# EAGLE schematic MOL-v1.0 (EAGLE 8.2.2)
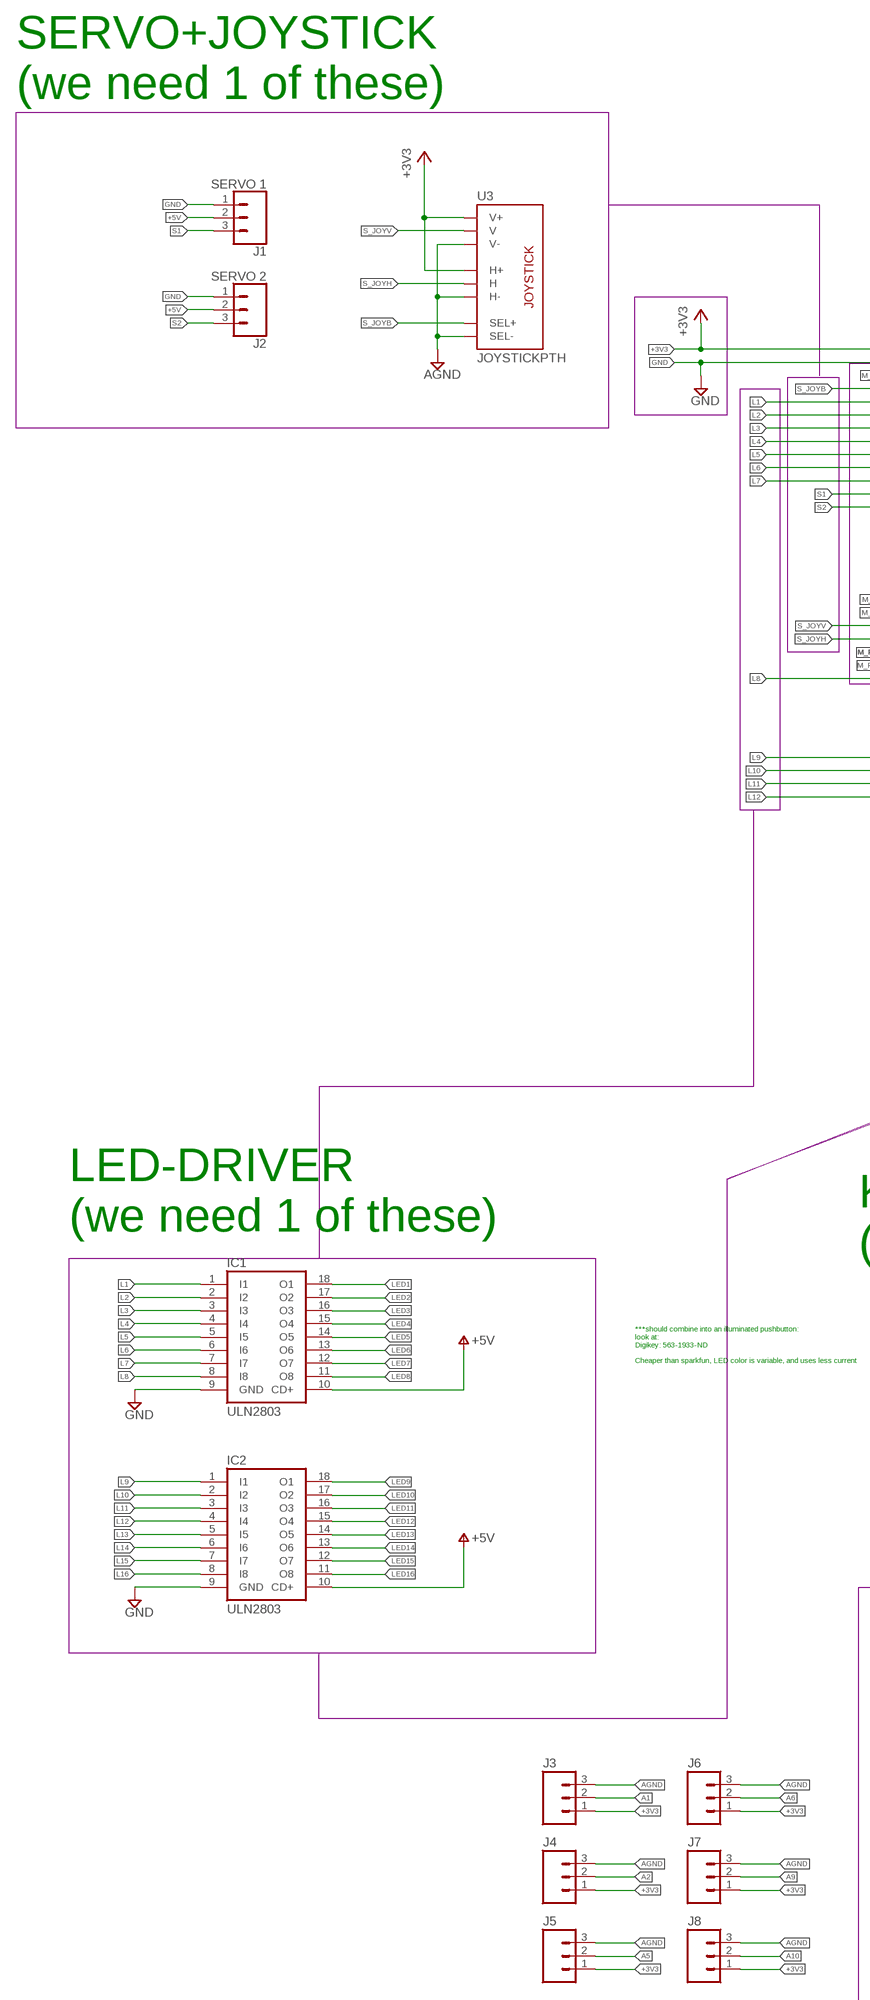
[diagram p0: schematic, sheet 1, part 1 of 2]
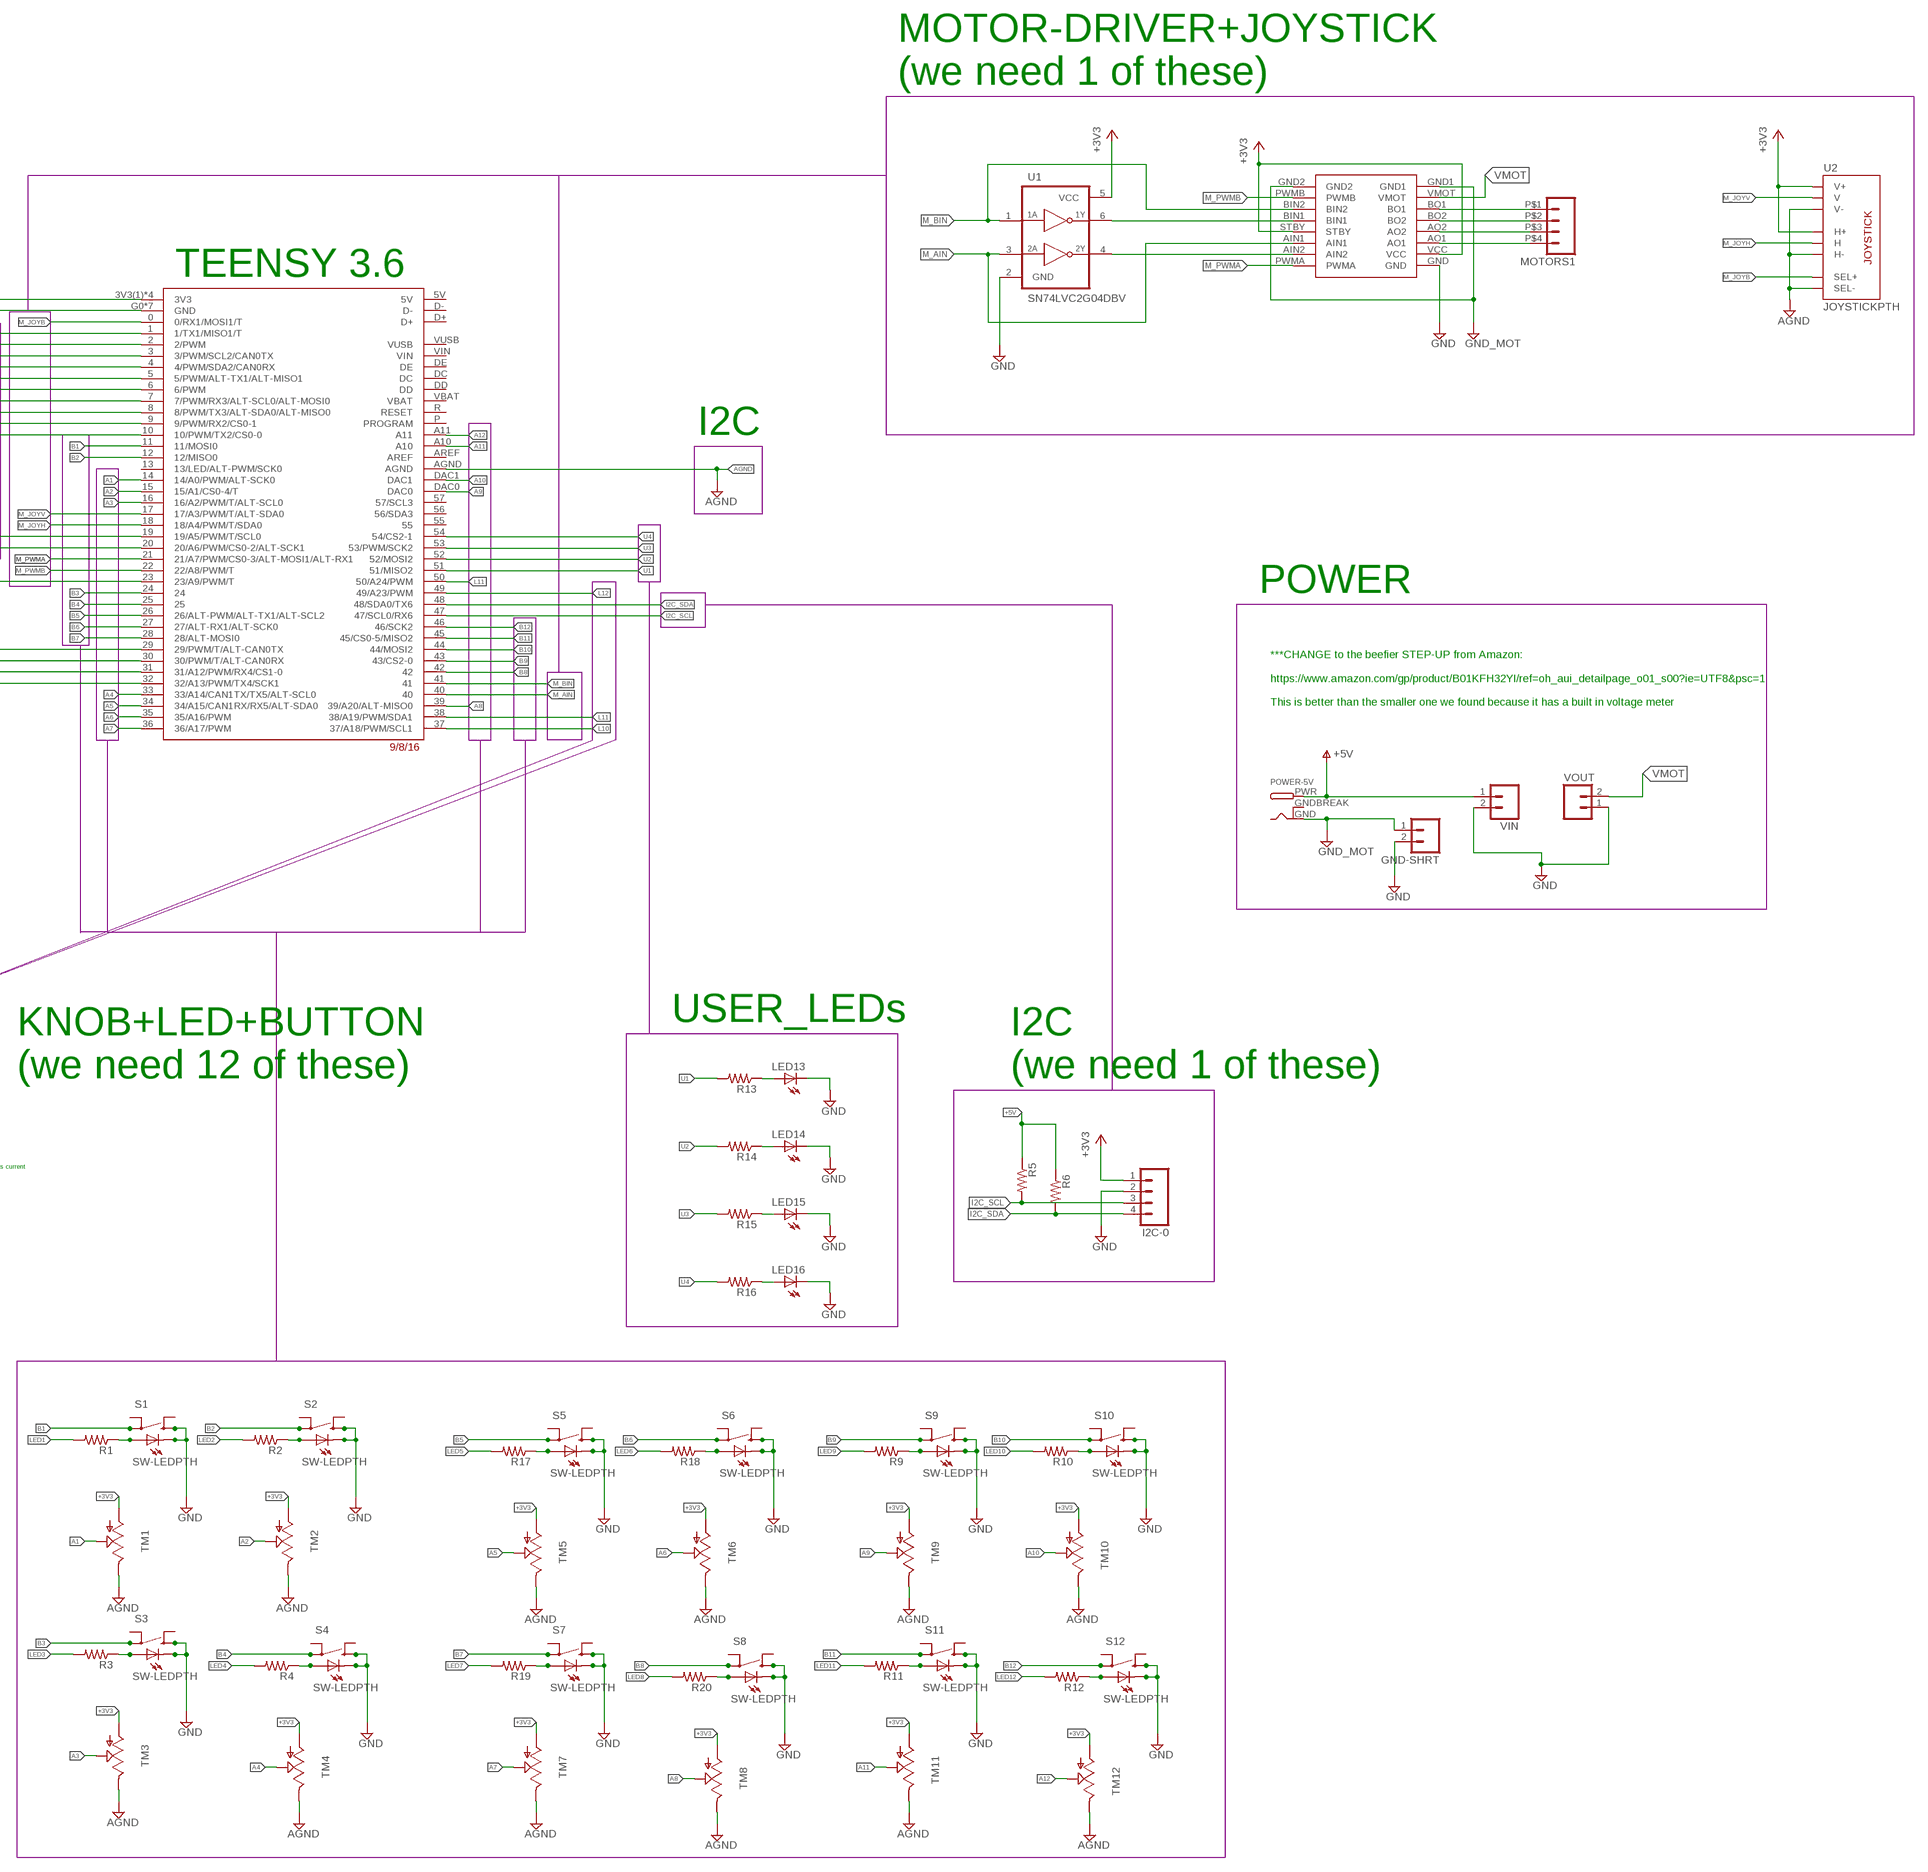
[diagram p1: schematic, sheet 1, part 2 of 2]

## Parts
GND-SHRT  M02LOCK  [1X02_LOCK]
I2C-0  M04LOCK  [1X04_LOCK]
IC1  ULN2803  ULN2803A  [DIL18]
IC2  ULN2803  ULN2803A  [DIL18]
J1  SERVO 1  CONN_03LOCK  [1X03_LOCK@1]
J2  SERVO 2  CONN_03LOCK  [1X03_LOCK@1]
J3  M031X03_NO_SILK  [1X03_NO_SILK]
J4  M031X03_NO_SILK  [1X03_NO_SILK]
J5  M031X03_NO_SILK  [1X03_NO_SILK]
J6  M031X03_NO_SILK  [1X03_NO_SILK]
J7  M031X03_NO_SILK  [1X03_NO_SILK]
J8  M031X03_NO_SILK  [1X03_NO_SILK]
LED13  LED3MM  [LED3MM]
LED14  LED3MM  [LED3MM]
LED15  LED3MM  [LED3MM]
LED16  LED3MM  [LED3MM]
MOTORS1  M04  [SPRINGTERMINAL-2.54MM-4]
POWER-5V  DCBARRELPTH  [DCJACK_2MM_PTH]
R1  RESISTOREZ  [AXIAL-0.3EZ]
R2  RESISTOREZ  [AXIAL-0.3EZ]
R3  RESISTOREZ  [AXIAL-0.3EZ]
R4  RESISTOREZ  [AXIAL-0.3EZ]
R5  RESISTOREZ  [AXIAL-0.3EZ]
R6  RESISTOREZ  [AXIAL-0.3EZ]
R9  RESISTOREZ  [AXIAL-0.3EZ]
R10  RESISTOREZ  [AXIAL-0.3EZ]
R11  RESISTOREZ  [AXIAL-0.3EZ]
R12  RESISTOREZ  [AXIAL-0.3EZ]
R13  RESISTOREZ  [AXIAL-0.3EZ]
R14  RESISTOREZ  [AXIAL-0.3EZ]
R15  RESISTOREZ  [AXIAL-0.3EZ]
R16  RESISTOREZ  [AXIAL-0.3EZ]
R17  RESISTOREZ  [AXIAL-0.3EZ]
R18  RESISTOREZ  [AXIAL-0.3EZ]
R19  RESISTOREZ  [AXIAL-0.3EZ]
R20  RESISTOREZ  [AXIAL-0.3EZ]
S1  SW-LEDPTH  [TR2-SWITCH-MOMENTARY-LED]
S2  SW-LEDPTH  [TR2-SWITCH-MOMENTARY-LED]
S3  SW-LEDPTH  [TR2-SWITCH-MOMENTARY-LED]
S4  SW-LEDPTH  [TR2-SWITCH-MOMENTARY-LED]
S5  SW-LEDPTH  [TR2-SWITCH-MOMENTARY-LED]
S6  SW-LEDPTH  [TR2-SWITCH-MOMENTARY-LED]
S7  SW-LEDPTH  [TR2-SWITCH-MOMENTARY-LED]
S8  SW-LEDPTH  [TR2-SWITCH-MOMENTARY-LED]
S9  SW-LEDPTH  [TR2-SWITCH-MOMENTARY-LED]
S10  SW-LEDPTH  [TR2-SWITCH-MOMENTARY-LED]
S11  SW-LEDPTH  [TR2-SWITCH-MOMENTARY-LED]
S12  SW-LEDPTH  [TR2-SWITCH-MOMENTARY-LED]
TM1  TRIM  [TRIM-PCB-9MM]
TM2  TRIM  [TRIM-PCB-9MM]
TM3  TRIM  [TRIM-PCB-9MM]
TM4  TRIM  [TRIM-PCB-9MM]
TM5  TRIM  [TRIM-PCB-9MM]
TM6  TRIM  [TRIM-PCB-9MM]
TM7  TRIM  [TRIM-PCB-9MM]
TM8  TRIM  [TRIM-PCB-9MM]
TM9  TRIM  [TRIM-PCB-9MM]
TM10  TRIM  [TRIM-PCB-9MM]
TM11  TRIM  [TRIM-PCB-9MM]
TM12  TRIM  [TRIM-PCB-9MM]
U1  SN74LVC2G04DBV  [SOT23-6]
U2  JOYSTICKPTH  [JOYSTICK]
U3  JOYSTICKPTH  [JOYSTICK]
U$1  TEENSY3_6--ALLPINS  [T36]
U$7  POLOLU_TB6612FNG  [POLOLU_TB6612FNG]
VIN  M02LOCK  [1X02_LOCK]
VOUT  M02LOCK  [1X02_LOCK]

## Nets
+3V3: I2C-0.1 J3.1 J4.1 J5.1 J6.1 J7.1 J8.1 TM1.1(A) TM2.1(A) TM3.1(A) TM4.1(A) TM5.1(A) TM6.1(A) TM7.1(A) TM8.1(A) TM9.1(A) TM10.1(A) TM11.1(A) TM12.1(A) U1.5(VCC) U2.H1(H+) U2.V1(V+) U3.H1(H+) U3.V1(V+) U$1.3V3(1)(3V3) U$1.3V3(2)(3V3) U$1.3V3(3)(3V3) U$1.3V3(4)(3V3) U$7.STBY U$7.VCC
+5V [Power]: IC1.10(CD+) IC2.10(CD+) J1.2 J2.2 POWER-5V.PWR R5.P$1 R6.P$1 VIN.1 ; supply symbol labelled V+
A1 [Analog Sig]: J3.2 TM1.2(S) U$1.14(14/A0/PWM/ALT-SCK0)
A2 [Analog Sig]: J4.2 TM2.2(S) U$1.15(15/A1/CS0-4/T)
A3 [Analog Sig]: TM3.2(S) U$1.16(16/A2/PWM/T/ALT-SCL0)
A4 [Analog Sig]: TM4.2(S) U$1.33(33/A14/CAN1TX/TX5/ALT-SCL0)
A5 [Analog Sig]: J5.2 TM5.2(S) U$1.34(34/A15/CAN1RX/RX5/ALT-SDA0)
A6 [Analog Sig]: J6.2 TM6.2(S) U$1.35(35/A16/PWM)
A7 [Analog Sig]: TM7.2(S) U$1.36(36/A17/PWM)
A8 [Analog Sig]: TM8.2(S) U$1.39(39/A20/ALT-MISO0)
A9 [Analog Sig]: J7.2 TM9.2(S) U$1.DAC0
A10 [Analog Sig]: J8.2 TM10.2(S) U$1.DAC1
A11 [Analog Sig]: TM11.2(S) U$1.A10
A12 [Analog Sig]: TM12.2(S) U$1.A11
AGND [Analog Sig]: J3.3 J4.3 J5.3 J6.3 J7.3 J8.3 TM1.3(E) TM2.3(E) TM3.3(E) TM4.3(E) TM5.3(E) TM6.3(E) TM7.3(E) TM8.3(E) TM9.3(E) TM10.3(E) TM11.3(E) TM12.3(E) U2.B2A(SEL-) U2.H3(H-) U2.V3(V-) U3.B2A(SEL-) U3.H3(H-) U3.V3(V-) U$1.AGND
B1: S1.3 U$1.11(11/MOSI0)
B2: S2.3 U$1.12(12/MISO0)
B3: S3.3 U$1.24
B4: S4.3 U$1.25
B5: S5.3 U$1.26(26/ALT-PWM/ALT-TX1/ALT-SCL2)
B6: S6.3 U$1.27(27/ALT-RX1/ALT-SCK0)
B7: S7.3 U$1.28(28/ALT-MOSI0)
B8: S8.3 U$1.42
B9: S9.3 U$1.43(43/CS2-0)
B10: S10.3 U$1.44(44/MOSI2)
B11: S11.3 U$1.45(45/CS0-5/MISO2)
B12: S12.3 U$1.46(46/SCK2)
GND: GND-SHRT.2 I2C-0.2 IC1.9(GND) IC2.9(GND) J1.1 J2.1 LED13.K(C) LED14.K(C) LED15.K(C) LED16.K(C) S1.1 S1.C S2.1 S2.C S3.1 S3.C S4.1 S4.C S5.1 S5.C S6.1 S6.C S7.1 S7.C S8.1 S8.C S9.1 S9.C S10.1 S10.C S11.1 S11.C S12.1 S12.C U1.2(GND) U$1.G0(GND) U$1.G1(GND) U$1.G2(GND) U$1.G3(GND) U$1.G4(GND) U$1.G5(GND) U$1.G6(GND) U$7.GND VIN.2 VOUT.1
GND_MOT [Power]: GND-SHRT.1 POWER-5V.GND U$7.GND1 U$7.GND2
I2C_SCL: I2C-0.3 R5.P$2 U$1.47(47/SCL0/RX6)
I2C_SDA: I2C-0.4 R6.P$2 U$1.48(48/SDA0/TX6)
L1: IC1.1(I1) U$1.2(2/PWM)
L2: IC1.2(I2) U$1.3(3/PWM/SCL2/CAN0TX)
L3: IC1.3(I3) U$1.4(4/PWM/SDA2/CAN0RX)
L4: IC1.4(I4) U$1.5(5/PWM/ALT-TX1/ALT-MISO1)
L5: IC1.5(I5) U$1.6(6/PWM)
L6: IC1.6(I6) U$1.7(7/PWM/RX3/ALT-SCL0/ALT-MOSI0)
L7: IC1.7(I7) U$1.8(8/PWM/TX3/ALT-SDA0/ALT-MISO0)
L8: IC1.8(I8) U$1.23(23/A9/PWM/T)
L9: IC2.1(I1) U$1.29(29/PWM/T/ALT-CAN0TX)
L10: IC2.2(I2) U$1.30(30/PWM/T/ALT-CAN0RX) U$1.37(37/A18/PWM/SCL1)
L11: IC2.3(I3) U$1.31(31/A12/PWM/RX4/CS1-0) U$1.38(38/A19/PWM/SDA1) U$1.50(50/A24/PWM)
L12: IC2.4(I4) U$1.32(32/A13/PWM/TX4/SCK1) U$1.49(49/A23/PWM)
L13: IC2.5(I5)
L14: IC2.6(I6)
L15: IC2.7(I7)
L16: IC2.8(I8)
LED1: IC1.18(O1) R1.P$2
LED2: IC1.17(O2) R2.P$2
LED3: IC1.16(O3) R3.P$2
LED4: IC1.15(O4) R4.P$2
LED5: IC1.14(O5) R17.P$2
LED6: IC1.13(O6) R18.P$2
LED7: IC1.12(O7) R19.P$2
LED8: IC1.11(O8) R20.P$2
LED9: IC2.18(O1) R9.P$2
LED10: IC2.17(O2) R10.P$2
LED11: IC2.16(O3) R11.P$2
LED12: IC2.15(O4) R12.P$2
LED13: IC2.14(O5)
LED14: IC2.13(O6)
LED15: IC2.12(O7)
LED16: IC2.11(O8)
M_AIN: U1.3(2A) U$1.40 U$7.AIN1
M_BIN: U1.1(1A) U$1.41 U$7.BIN2
M_JOYB: U2.B1A(SEL+) U$1.0(0/RX1/MOSI1/T)
M_JOYH [Analog Sig]: U2.H2(H) U$1.18(18/A4/PWM/T/SDA0)
M_JOYV [Analog Sig]: U2.V2(V) U$1.17(17/A3/PWM/T/ALT-SDA0)
M_PWMA: U$1.21(21/A7/PWM/CS0-3/ALT-MOSI1/ALT-RX1) U$7.PWMA
M_PWMB: U$1.22(22/A8/PWM/T) U$7.PWMB
N$1: R1.P$1 S1.A
N$2: LED13.A R13.P$1
N$3: LED14.A R14.P$1
N$4: LED15.A R15.P$1
N$5: U1.6(1Y) U$7.BIN1
N$6: U1.4(2Y) U$7.AIN2
N$7: LED16.A R16.P$1
N$8: R2.P$1 S2.A
N$9: R3.P$1 S3.A
N$10: R4.P$1 S4.A
N$15: R9.P$1 S9.A
N$16: R10.P$1 S10.A
N$17: R11.P$1 S11.A
N$18: R12.P$1 S12.A
N$19: R17.P$1 S5.A
N$20: R18.P$1 S6.A
N$21: R19.P$1 S7.A
N$22: R20.P$1 S8.A
N$45 [Power]: MOTORS1.P$1 U$7.BO1
N$46 [Power]: MOTORS1.P$2 U$7.BO2
N$52 [Power]: MOTORS1.P$3 U$7.AO2
N$54 [Power]: MOTORS1.P$4 U$7.AO1
S1: J1.3 U$1.9(9/PWM/RX2/CS0-1)
S2: J2.3 U$1.10(10/PWM/TX2/CS0-0)
S_JOYB: U3.B1A(SEL+) U$1.1(1/TX1/MISO1/T)
S_JOYH [Analog Sig]: U3.H2(H) U$1.20(20/A6/PWM/CS0-2/ALT-SCK1)
S_JOYV [Analog Sig]: U3.V2(V) U$1.19(19/A5/PWM/T/SCL0)
U1: R13.P$2 U$1.51(51/MISO2)
U2: R14.P$2 U$1.52(52/MOSI2)
U3: R15.P$2 U$1.53(53/PWM/SCK2)
U4: R16.P$2 U$1.54(54/CS2-1)
VMOT [Power]: U$7.VMOT VOUT.2
Unconnected: S1.2 S1.4 S2.2 S2.4 S3.2 S3.4 S4.2 S4.4 S5.2 S5.4 S6.2 S6.4 S7.2 S7.4 S8.2 S8.4 S9.2 S9.4 S10.2 S10.4 S11.2 S11.4 S12.2 S12.4 U$1.5V U$1.13(13/LED/ALT-PWM/SCK0) U$1.55 U$1.56(56/SDA3) U$1.57(57/SCL3) U$1.AREF U$1.D+ U$1.D- U$1.DC U$1.DD U$1.DE U$1.P(PROGRAM) U$1.R(RESET) U$1.VBAT U$1.VIN U$1.VUSB

## Notes on the sheet
- SERVO+JOYSTICK
  (we need 1 of these)
- MOTOR-DRIVER+JOYSTICK
  (we need 1 of these)
- TEENSY 3.6
- I2C
- POWER
- ***CHANGE to the beefier STEP-UP from Amazon:
  
  https://www.amazon.com/gp/product/B01KFH32YI/ref=oh_aui_detailpage_o01_s00?ie=UTF8&psc=1
  
  This is better than the smaller one we found because it has a built in voltage meter
- USER_LEDs
- LED-DRIVER
  (we need 1 of these)
- KNOB+LED+BUTTON
  (we need 12 of these)
- I2C
  (we need 1 of these)
- ***should combine into an illuminated pushbutton:
  look at:
  Digikey: 563-1933-ND
  
  Cheaper than sparkfun, LED color is variable, and uses less current

## Power pins joined to a net without a drawn wire
GNDBREAK: POWER-5V.GNDBREAK

## Library data of the parts
GND-SHRT VIN VOUT = CMU-ArtFab:M02: Header 2 Standard 2-pin 0.1" header. Use with straight break away headers (SKU : PRT-00116), right angle break away headers (PRT-00553), swiss pins (PRT-00743), machine pins (PRT-00117), and female headers (PRT-00115). Molex polarized connector foot print use with SKU : PRT-08233 with associated crimp pins and housings.
I2C-0 MOTORS1 = CMU-ArtFab:M04: Header 4 Standard 4-pin 0.1" header. Use with straight break away headers (SKU : PRT-00116), right angle break away headers (PRT-00553), swiss pins (PRT-00743), machine pins (PRT-00117), and female headers (PRT-00115). Molex polarized connector foot print use with SKU : PRT-08231 with associated crimp pins and housings. 1MM SMD Version SKU: PRT-10208
IC1 IC2 = uln-udn:ULN2803A: DRIVER ARRAY
J1 J2 = SparkFun-Connectors:CONN_03: Multi connection point. Often used as Generic Header-pin footprint for 0.1 inch spaced/style header connections On any of the 0.1 inch spaced packages, you can populate with these: Break Away Headers - Straight <https://www.sparkfun.com/products/116> (PRT-00116) Break Away Male Headers - Right Angle <https://www.sparkfun.com/products/553> (PRT-00553) Female Headers <https://www.sparkfun.com/products/115> (PRT-00115) Break Away Headers - Machine Pin <https://www.sparkfun.com/products/117> (PRT-00117) Break Away Female Headers - Swiss Machine Pin <https://www.sparkfun.com/products/743> (PRT-00743) Stackable Header - 3 Pin (Female, 0.1") <https://www.sparkfun.com/products/13875> (PRT-13875) For SCREWTERMINALS and SPRING TERMINALS visit here: Screw Terimnals on SparkFun.com <https://www.sparkfun.com/search/results?term=Screw+Terminals> (5mm/3.5mm/2.54mm spacing) This device is also useful as a general connection point to wire up your design to another part of your project. Our various solder wires solder well into these plated through hole pads. Hook-Up Wire - Assortment (Stranded, 22 AWG) <https://www.sparkfun.com/products/11375> (PRT-11375) Hook-Up Wire - Assortment (Solid Core, 22 AWG) <https://www.sparkfun.com/products/11367> (PRT-11367) View the entire wire category on our website here <https://www.sparkfun.com/categories/141> Special notes: Molex polarized connector foot print use with SKU : PRT-08232 with associated crimp pins and housings.
J3-J8 = SparkFun-Connectors:M03: Header 3 Standard 3-pin 0.1" header. Use with straight break away headers (SKU : PRT-00116), right angle break away headers (PRT-00553), swiss pins (PRT-00743), machine pins (PRT-00117), and female headers (PRT-00115). Molex polarized connector foot print use with SKU : PRT-08232 with associated crimp pins and housings.
LED13-LED16 = led:LED: LED OSRAM: - CHIPLED LG R971, LG N971, LY N971, LG Q971, LY Q971, LO R971, LY R971 LH N974, LH R974 LS Q976, LO Q976, LY Q976 LO Q996 - Hyper CHIPLED LW Q18S LB Q993, LB Q99A, LB R99A - SideLED LS A670, LO A670, LY A670, LG A670, LP A670 LB A673, LV A673, LT A673, LW A673 LH A674 LY A675 LS A676, LA A676, LO A676, LY A676, LW A676 LS A679, LY A679, LG A679 - Hyper Micro SIDELED® LS Y876, LA Y876, LO Y876, LY Y876 LT Y87S - SmartLED LW L88C, LW L88S LB L89C, LB L89S, LG L890 LS L89K, LO L89K, LY L89K LS L896, LA L896, LO L896, LY L896 - TOPLED LS T670, LO T670, LY T670, LG T670, LP T670 LSG T670, LSP T670, LSY T670, LOP T670, LYG T670 LG T671, LOG T671, LSG T671 LB T673, LV T673, LT T673, LW T673 LH T674 LS T676, LA T676, LO T676, LY T676, LB T676, LH T676, LSB T676, LW T676 LB T67C, LV T67C, LT T67C, LS T67K, LO T67K, LY T67K, LW E67C LS E67B, LA E67B, LO E67B, LY E67B, LB E67C, LV E67C, LT E67C LW T67C LS T679, LY T679, LG T679 LS T770, LO T770, LY T770, LG T770, LP T770 LB T773, LV T773, LT T773, LW T773 LH T774 LS E675, LA E675, LY E675, LS T675 LS T776, LA T776, LO T776, LY T776, LB T776 LHGB T686 LT T68C, LB T68C - Hyper Mini TOPLED® LB M676 - Mini TOPLED Santana® LG M470 LS M47K, LO M47K, LY M47K Source: http://www.osram.convergy.de LUXEON: - LUMILED® LXK2-PW12-R00, LXK2-PW12-S00, LXK2-PW14-U00, LXK2-PW14-V00 LXK2-PM12-R00, LXK2-PM12-S00, LXK2-PM14-U00 LXK2-PE12-Q00, LXK2-PE12-R00, LXK2-PE12-S00, LXK2-PE14-T00, LXK2-PE14-U00 LXK2-PB12-K00, LXK2-PB12-L00, LXK2-PB12-M00, LXK2-PB14-N00, LXK2-PB14-P00, LXK2-PB14-Q00 LXK2-PR12-L00, LXK2-PR12-M00, LXK2-PR14-Q00, LXK2-PR14-R00 LXK2-PD12-Q00, LXK2-PD12-R00, LXK2-PD12-S00 LXK2-PH12-R00, LXK2-PH12-S00 LXK2-PL12-P00, LXK2-PL12-Q00, LXK2-PL12-R00 Source: www.luxeon.com KINGBRIGHT: KA-3528ASYC Source: www.kingbright.com
POWER-5V = adafruit:DCBARREL: 2.0mm DC Barrel Jack DCJACK_2MM_PTH - Through Hole Jack (4UConnector: 05537)
R1-R6 R9-R20 = SparkFun-Resistors:RESISTOR: Resistor Basic schematic elements and footprints for 0603, 1206, and PTH resistors.
S1-S12 = Daniel:SW-LED: SWITCH PUSH SPST-NO 10MA 12V
TM1-TM12 = Daniel:TRIM
U1 = 74LV:SN74LVC2G04: DUAL INVERTER GATE
U2 U3 = adafruit:JOYSTICK: Thumb Joystick Joystick commonly found in PS2 controllers. Two pots and a select switch. Adapted from Sparkfun Library (but for more common 6mm switch sticks)
U$1 = Teensy_3_6:TEENSY3_6--ALLPINS
U$7 = CMU-ArtFab:POLOLU_TB6612FNG

## Net classes
2 Power: width 0.381 mm, clearance 0.279 mm
3 Analog Sig: width 0.381 mm, clearance 0.279 mm